# Altium project SelfoDryer.PrjPcb
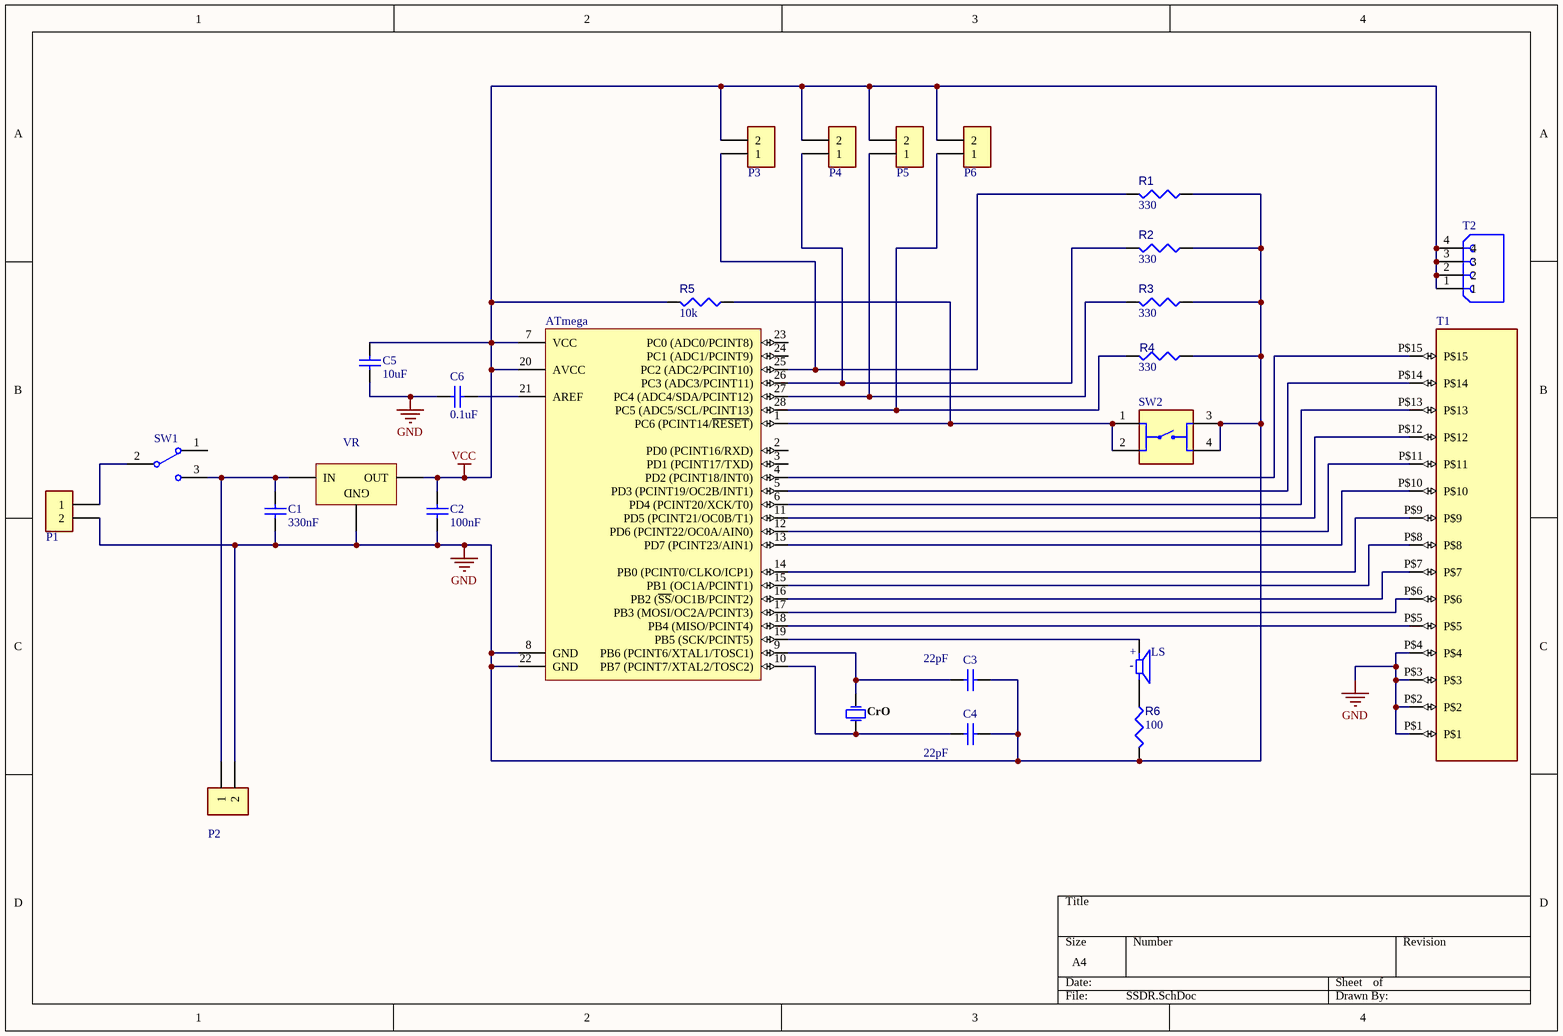
[diagram p0: SSDR.SchDoc]
1 sheet, 26 parts. Net scope: global (net labels, ports and power ports of the same name join across sheets).
Board file: SSDR.PcbDoc

## Sheet SSDR.SchDoc
size A4; SheetNumber: 1; SheetTotal: 1

### Parts
ATmega  ATMEGA328P-PU  [ATML-28P3]  (value not drawn)
C1  330nF  [KEMT-C315-THT-2]
C2  100nF  [KEMT-C315-THT-2]
C3  22pF  [KEMT-C315-THT-2]
C4  22pF  [KEMT-C315-THT-2]
C5  10uF  [KEMT-C315-THT-2]
C6  0.1uF  [KEMT-C315-THT-2]
CrO  FOXSLF/160-20  [FOX-FOXSLF160-20]  (value not drawn)
LS  PKM17EPP-2002-B0  [SPKR_PKM17EPP-2002-B0]  (value not drawn)
P1  282837-2  [TE_282837-2]  (value not drawn)
P2  282837-2  [TE_282837-2]  (value not drawn)
P3  282837-2  [TE_282837-2]  (value not drawn)
P4  282837-2  [TE_282837-2]  (value not drawn)
P5  282837-2  [TE_282837-2]  (value not drawn)
P6  282837-2  [TE_282837-2]  (value not drawn)
R1  value 330  [RESA60-630X240]  (hidden comment: CFR-25JB-52-470K)
R2  value 330  [RESA60-630X240]  (hidden comment: CFR-25JB-52-470K)
R3  value 330  [RESA60-630X240]  (hidden comment: CFR-25JB-52-470K)
R4  value 330  [RESA60-630X240]  (hidden comment: CFR-25JB-52-470K)
R5  value 10k  [RESA60-630X240]  (hidden comment: CFR-25JB-52-470K)
R6  value 100  [RESA60-630X240]  (hidden comment: CFR-25JB-52-470K)
SW1  EG1218  [ESWI-EG1218_V]  (value not drawn)
SW2  1825910-6  [SW_1825910-6-4]  (value not drawn)
T1  PPTC151LFBN-RC  [PPTC151LFBN-RC]  (value not drawn)
T2  PPTC041LFBN-RC  [SULLINS_PPTC041LFBN-RC]  (value not drawn)
VR  L7805CV  [TO220]  (value not drawn)

### Nets
GND: ATmega.8(GND) ATmega.22(GND) C1.1 C2.1 C3.2 C4.2 C5.1 C6.2 P1.2 P2.2 R1.1 R2.1 R3.1 R4.1 R6.2 SW2.3 SW2.4 T1.P$1 T1.P$2 T1.P$3 T1.P$4 VR.2(GND)
VCC: ATmega.7(VCC) ATmega.20(AVCC) C2.2 C5.2 P3.2 P4.2 P5.2 P6.2 R5.2 T2.1 T2.2 T2.3 T2.4 VR.3(OUT)
NetATmega_1: ATmega.1(PC6_(PCINT14/~{RESET})) R5.1 SW2.1 SW2.2
NetATmega_4: ATmega.4(PD2_(PCINT18/INT0)) T1.P$15
NetATmega_5: ATmega.5(PD3_(PCINT19/OC2B/INT1)) T1.P$14
NetATmega_6: ATmega.6(PD4_(PCINT20/XCK/T0)) T1.P$13
NetATmega_9: ATmega.9(PB6_(PCINT6/XTAL1/TOSC1)) C3.1 CrO.2
NetATmega_10: ATmega.10(PB7_(PCINT7/XTAL2/TOSC2)) C4.1 CrO.1
NetATmega_11: ATmega.11(PD5_(PCINT21/OC0B/T1)) T1.P$12
NetATmega_12: ATmega.12(PD6_(PCINT22/OC0A/AIN0)) T1.P$11
NetATmega_13: ATmega.13(PD7_(PCINT23/AIN1)) T1.P$10
NetATmega_14: ATmega.14(PB0_(PCINT0/CLKO/ICP1)) T1.P$9
NetATmega_15: ATmega.15(PB1_(OC1A/PCINT1)) T1.P$8
NetATmega_16: ATmega.16(PB2_(~{SS}/OC1B/PCINT2)) T1.P$7
NetATmega_17: ATmega.17(PB3_(MOSI/OC2A/PCINT3)) T1.P$6
NetATmega_18: ATmega.18(PB4_(MISO/PCINT4)) T1.P$5
NetATmega_19: ATmega.19(PB5_(SCK/PCINT5)) LS.P
NetATmega_21: ATmega.21(AREF) C6.1
NetATmega_25: ATmega.25(PC2_(ADC2/PCINT10)) P3.1 R1.2
NetATmega_26: ATmega.26(PC3_(ADC3/PCINT11)) P4.1 R2.2
NetATmega_27: ATmega.27(PC4_(ADC4/SDA/PCINT12)) P5.1 R3.2
NetATmega_28: ATmega.28(PC5_(ADC5/SCL/PCINT13)) P6.1 R4.2
NetC1_2: C1.2 P2.1 SW1.3 VR.1(IN)
NetLS_N: LS.N R6.1
NetP1_1: P1.1 SW1.2(COM)

Not connected (* = marked no-connect by the designer): ATmega 2(PD0_(PCINT16/RXD)) 3(PD1_(PCINT17/TXD)) 23(PC0_(ADC0/PCINT8)) 24(PC1_(ADC1/PCINT9)); SW1 1

### Notes on the sheet
- (in symbol CMP-017-000001-1) +; -

### Library data of the parts
ATmega = CMP-020-00004-3: 8-Bit Microcontroller with 32 KBytes In-System Programmable Flash, 23 I/Os, -40 to 85 degC, 28-Pin PDIP (28P3), RoHS, Tube; Manufacturer: Atmel; I/Os: 23; Density: 32KB; Package Version: Rev. B, 09/2001; Max Clock Frequency: 20MHz; Interface: USART; Max Supply Voltage: 5.5V; Min Supply Voltage: 1.8V; Ethernet Channels: 0; RAM Size: 2KB; RoHS Compliant: True; Datasheet URL: http://www.atmel.com/images/Atmel-8271-8-bit-AVR-Microcontroller-ATmega48A-48PA-88A-88PA-168A-168PA-328-328P_datasheet_Complete.pdf; Packaging: Rail/Tube; Manufacturer URL: http://www.atmel.com/; Mounting Technology: TH; Package URL: http://www.atmel.com/images/Atmel-8271-8-bit-AVR-Microcontroller-ATmega48A-48PA-88A-88PA-168A-168PA-328-328P_datasheet_Complete.pdf; Datasheet Version: Rev. 8271J, 11/2015; Package Description: 28-Pin Plastic Dual Inline Package, Body 34.671 x 7.3025 mm, Pitch 2.54 mm; Package Quantity: 14; Min Operating Temperature: -40°C; Max Operating Temperature: 85°C; Case/Package: DIP; Pins: 28; Package Reference: 28P3
C1-C6 = CMP-1664-00008-1: Capacitor, Ceramic, 22 pF, +/-10 %, 100 V, -55 to 125 degC, 2-Pin THD, RoHS, Bulk; Max Input Voltage: 40 V; Min Input Voltage: 4.2 V; Output Current: 1.5 A; Output Voltage: 1.2 V; Outputs: 1; Case\Package: TO-220; RoHSCompliant: true; Min Operating Temperature: 0 degC; Max Operating Temperature: 125 degC; Package Quantity: 50; ComponentLink2URL: http://capacitoredge.kemet.com/capedge2/DataSheet/Datasheet-C315C220K1G5TA.pdf?pn=C315C220K1G5TA{BULK}; Radiation Hardening: No; Pins: 3; Length: 10.28 mm; ComponentLink1URL: http://www.kemet.com/; ComponentLink2Description: Datasheet; Height: 9.28 mm; REACH SVHC: No SVHC; ComponentLink1Description: Manufacturer URL; Max Ouput Current: 1.5 A; Weight: 0.08113 oz; Packaging: Rail/Tube; DatasheetVersion: Aug-16; Mount: Through Hole; PackageReference: C315-THT-2; Width: 4.82 mm; PackageDescription: 2-Pin Through Hole Device, Body 3.81 x 2.54 mm
CrO = CMP-1749-00003-1: Resistance Weld Thru-Hole Crystal, 16 MHz, -20 to 70 degC, 2-Pin THD, RoHS, Bulk; Voltage Rating: 250 V; Tolerance: 1%; Resistance: 221 kohm; Case\Package: Axial; Power Rating: 250 mW; RoHSCompliant: true; Package Quantity: 200; Packaging: Bulk; Min Operating Temperature: -55 degC; DatasheetVersion: Mar-15; ComponentLink1URL: http://www.foxonline.com/; Max Operating Temperature: 155 degC; PackageReference: FOXSLF160-20; Mount: Through Hole; PackageDescription: 2-Pin Through Hole Device, Body 11.35 x 4.65 mm; ComponentLink1Description: Manufacturer URL; ComponentLink2URL: http://www.foxonline.com/pdfs/hc49slf.pdf; ComponentLink2Description: Datasheet; Length: 0.248 inch
LS = CMP-017-000001-1: Buzzers Transducer, Externally Driven Piezo 3V 2kHz 70dB @ 3V, 10cm Through Hole PC Pins; MP: PKM17EPP-2002-B0; Availability: Unavailable; Source: PKM17EPP-2002-B0.SchLib; Package: None; Design Item ID: PKM17EPP-2002-B0; Price: None; Pin Count: 2; Value: *; Component Type: Standard
P1-P6 = CMP-019-000000-1: Разъемные клеммные колодки Розетка 2 положения 5,08 мм Припой прямой через отверстие 13,5 А / контакт; MF: TE Connectivity; Design Item ID: 282837-2; SnapEDA_Link: https://www.snapeda.com/parts/282837-2/TE+Connectivity+AMP+Connectors/view-part/?ref=snap; Purchase-URL: https://pricing.snapeda.com/search/part/282837-2/?ref=eda; Pin Count: 2; Component Type: Standard; Source: 282837-2.SchLib; Value: *; Check_prices: https://www.snapeda.com/parts/282837-2/TE+Connectivity+AMP+Connectors/view-part/?ref=eda; MP: 282837-2; Availability: In Stock; Price: None; Package: None
R1-R6 = CMP-009-00055-4: RES 470K OHM 5% 1/4W AXIAL; Manufacturer: Yageo; Power: 250mW; Voltage Rating: 250V; Tolerance: 1%; Case/Package: Axial; Mounting Technology: TH; RoHS Compliant: True; Package Description: 2-Pin Axial Lead, Dia 2.4 mm, Body Length 6.3 mm; Min Operating Temperature: -55°C; Datasheet URL: http://www.yageo.com/documents/recent/Yageo%20LR_MFR_2013.pdf; Manufacturer URL: http://www.yageo.com/; Package Quantity: 200; Package Reference: MFR-25; Max Operating Temperature: 155°C; Datasheet Version: Apr-13; Packaging: Bulk
SW1 = CMP-011-00006-2: Slide Switch, SPDT, 500 V, -20 to 70 degC, 3-Pin THD, RoHS, Bulk; Manufacturer: E-Switch; Voltage Rating (DC): 30V; Current Rating: 200mA; Operating Force: 250gf; Package Quantity: 1000; Contact Plating: Silver; Max Operating Temperature: 70°C; Min Operating Temperature: -20°C; Contact Material: Copper; Datasheet URL: https://www.e-switch.com/system/asset/product_line/data_sheet/119/EG.pdf; Contact Finish: Silver; Case/Package: EG1218; Voltage Rating (AC): 30V; Datasheet Version: Oct-15; Package Description: 3-Pin Through Hole Device, Body 11.6 x 4 mm, Pitch 2.5 mm; RoHS Compliant: True; Package Reference: EG1218; Manufacturer URL: http://www.e-switch.ch/en/; Throw Configuration: SPDT; Contact Current Rating: 200mA; Mounting Technology: TH; Packaging: Bulk; Pins: 3
SW2 = CMP-011-00014-1: Switch Push Button OFF (ON) SPST Round Button 0.05A 24VDC Momentary Contact PC Pins Thru-Hole; MF: TE Connectivity; Purchase-URL: https://pricing.snapeda.com/search/part/1825910-6/?ref=eda; MP: 1825910-6; Digi-Key_Part_Number: 450-1650-ND; Design Item ID: 1825910-6; Component Type: Standard; Check_prices: https://www.snapeda.com/parts/1825910-6/TE+Connectivity+ALCOSWITCH+Switches/view-part/?ref=eda; Source: 1825910-6.SchLib; SnapEDA_Link: https://www.snapeda.com/parts/1825910-6/TE+Connectivity+ALCOSWITCH+Switches/view-part/?ref=snap; Case/Package: None; Value: *; Pins: 4
T1 = CMP-002-00072-1: 15 Position Header Connector Through Hole; MF: Sullins Connector; Price: None; Value: *; Case/Package: None; Source: SnapEDAsch.SchLib; Component Type: Standard; Availability: Unavailable; Design Item ID: PPTC151LFBN-RC; SnapEDA_Link: https://www.snapeda.com/parts/PPTC151LFBN-RC/Sullins%20Connector%20Solutions/view-part/592000/?ref=snap; MP: PPTC151LFBN-RC; Pins: 15
T2 = CMP-002-00073-1: 4 Position Header Connector 0.100 (2.54mm) Through Hole Tin; MF: Sullins Connector; Component Type: Standard; Case/Package: None; SnapEDA_Link: https://www.snapeda.com/parts/PPTC041LFBN-RC/Sullins+Connector+Solutions/view-part/?ref=snap; MP: PPTC041LFBN-RC; Purchase-URL: https://pricing.snapeda.com/search/part/PPTC041LFBN-RC/?ref=eda; Pins: 4; Value: *; Source: PPTC041LFBN-RC.SchLib; Digi-Key_Part_Number: S7002-ND; Design Item ID: PPTC041LFBN-RC; Check_prices: https://www.snapeda.com/parts/PPTC041LFBN-RC/Sullins+Connector+Solutions/view-part/?ref=eda
VR = CMP-019-00018-3: Manufacturer: STMicroelectronics; Max Input Voltage: 35V; Min Supply Voltage: 8V; Nominal Output Voltage: 5V; Outputs: 1; Output Current: 1.5A; Dropout Voltage: 2V; Max Supply Voltage: 20V; Min Input Voltage: 7V; Datasheet Version: Rev 30, 09/2012; Min Operating Temperature: 0°C; Manufacturer URL: http://www.st.com/; Pins: 3; Mounting Technology: TH; Output Voltage: 5V; RoHS Compliant: True; Max Ouput Current: 1.5A; Datasheet URL: https://datasheet.ciiva.com/15111/getdatasheetpartid-44136-15111027.pdf; Packaging: Rail/Tube; Max Operating Temperature: 125°C; Case/Package: TO-220; Package Quantity: 50